# EAGLE schematic vib_belt (EAGLE 9.3.0)
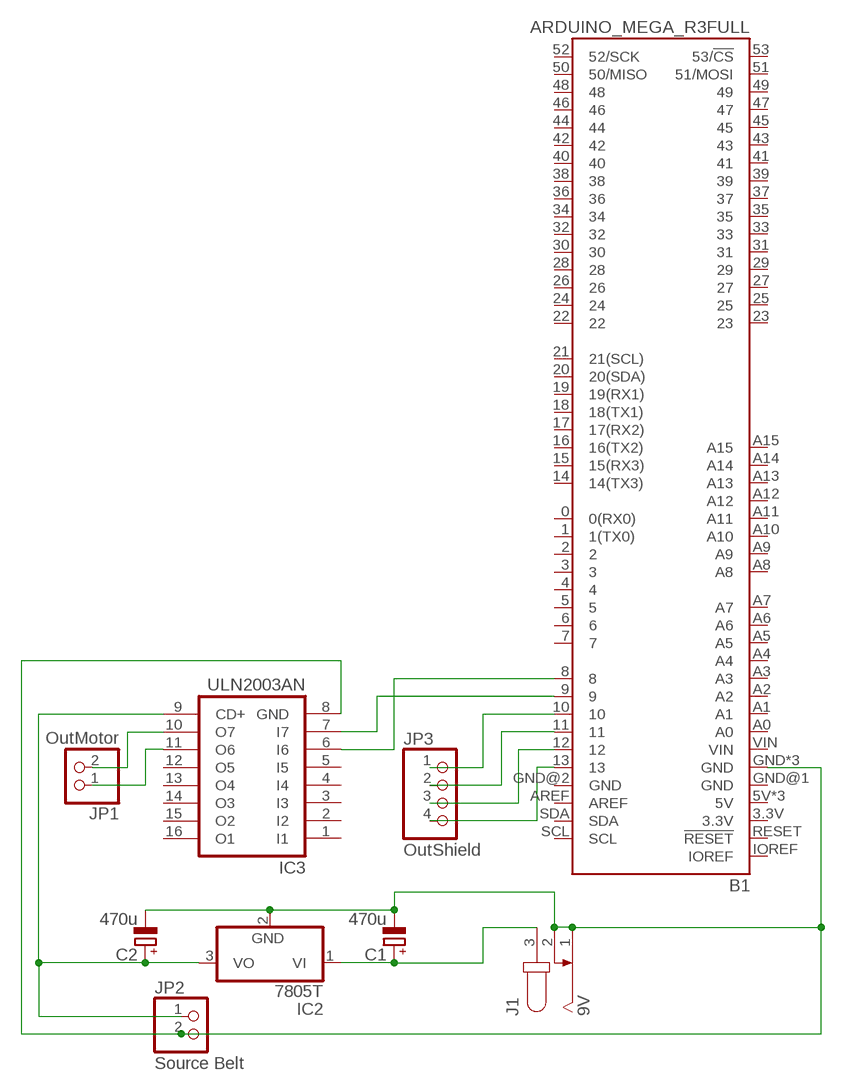
[diagram p0: schematic, sheet 1]

## Parts
B1  ARDUINO_MEGA_R3FULL  [ARDUINO_MEGA_NO_SILK]
C1  470u  CPOL-EUE5-6  [E5-6]
C2  470u  CPOL-EUE5-6  [E5-6]
IC2  7805T  [TO220H]
IC3  ULN2003AN  [DIL16]
J1  9V  JACK-PLUG0  [SPC4077]
JP1  OutMotor  PINHD-1X2/90  [1X02/90]
JP2  Source Belt  PINHD-1X2/90  [1X02/90]
JP3  OutShield  PINHD-1X4/90  [1X04/90]

## Nets
N$1: B1.GND B1.GND@3(GND) B1.GND@4(GND) C1.- C2.- IC2.2(GND) IC3.8(GND) J1.1 J1.2 JP2.2
N$2: B1.13 JP3.4
N$3: B1.12 JP3.3
N$4: B1.11 JP3.2
N$5: B1.10 JP3.1
N$6: IC3.10(O7) JP1.2
N$7: IC3.11(O6) JP1.1
N$8: B1.8 IC3.6(I6)
N$9: B1.9 IC3.7(I7)
N$11: C1.+ IC2.1(VI) J1.3
N$12: C2.+ IC2.3(VO) IC3.9(CD+) JP2.1
Unconnected: B1.0(0(RX0)) B1.1(1(TX0)) B1.2 B1.3 B1.3.3V B1.4 B1.5 B1.5V B1.5V@1(5V) B1.5V@2(5V) B1.6 B1.7 B1.14(14(TX3)) B1.15(15(RX3)) B1.16(16(TX2)) B1.17(17(RX2)) B1.18(18(TX1)) B1.19(19(RX1)) B1.20(20(SDA)) B1.21(21(SCL)) B1.22 B1.23 B1.24 B1.25 B1.26 B1.27 B1.28 B1.29 B1.30 B1.31 B1.32 B1.33 B1.34 B1.35 B1.36 B1.37 B1.38 B1.39 B1.40 B1.41 B1.42 B1.43 B1.44 B1.45 B1.46 B1.47 B1.48 B1.49 B1.50(50/MISO) B1.51(51/MOSI) B1.52(52/SCK) B1.53(53/!CS) B1.A0 B1.A1 B1.A2 B1.A3 B1.A4 B1.A5 B1.A6 B1.A7 B1.A8 B1.A9 B1.A10 B1.A11 B1.A12 B1.A13 B1.A14 B1.A15 B1.AREF B1.GND@1(GND) B1.GND@2(GND) B1.IOREF B1.RESET(!RESET) B1.SCL B1.SDA B1.VIN IC3.1(I1) IC3.2(I2) IC3.3(I3) IC3.4(I4) IC3.5(I5) IC3.12(O5) IC3.13(O4) IC3.14(O3) IC3.15(O2) IC3.16(O1)

## Library data of the parts
B1 = SparkFun-Boards:ARDUINO_MEGA_R3: Arduino Mega R3 ATmega2560 R3 compatible footprint. SparkFun Products: Arduino Mega 2560 R3 <https://www.sparkfun.com/products/11061>
C1 C2 = rcl:CPOL-EU: POLARIZED CAPACITOR, European symbol; SPICEPREFIX: C
IC2 = linear:78*: Positive VOLTAGE REGULATOR Source: http://cache.national.com/ds/LM/LM78L05.pdf http://www.fairchildsemi.com/ds/LM/LM7805.pdf
IC3 = uln-udn:ULN2003A: DRIVER ARRAY
J1 = con-jack:JACK-PLUG: DC POWER JACK Power Jack, DC, Right Angle, Through Hole, Rated 5A at 16VDC, PC Terminals Distributor: Farnell (www.Farnell.de) Drawing: 84N1161.pdf / 84N1162.pdf Manufacturer: SPC Technology (www.spctechnology.com) Type: SPC4077 / SPC 4078; OC_FARNELL: unknown; OC_NEWARK: unknown
JP1 JP2 = pinhead:PINHD-1X2: PIN HEADER
JP3 = pinhead:PINHD-1X4: PIN HEADER